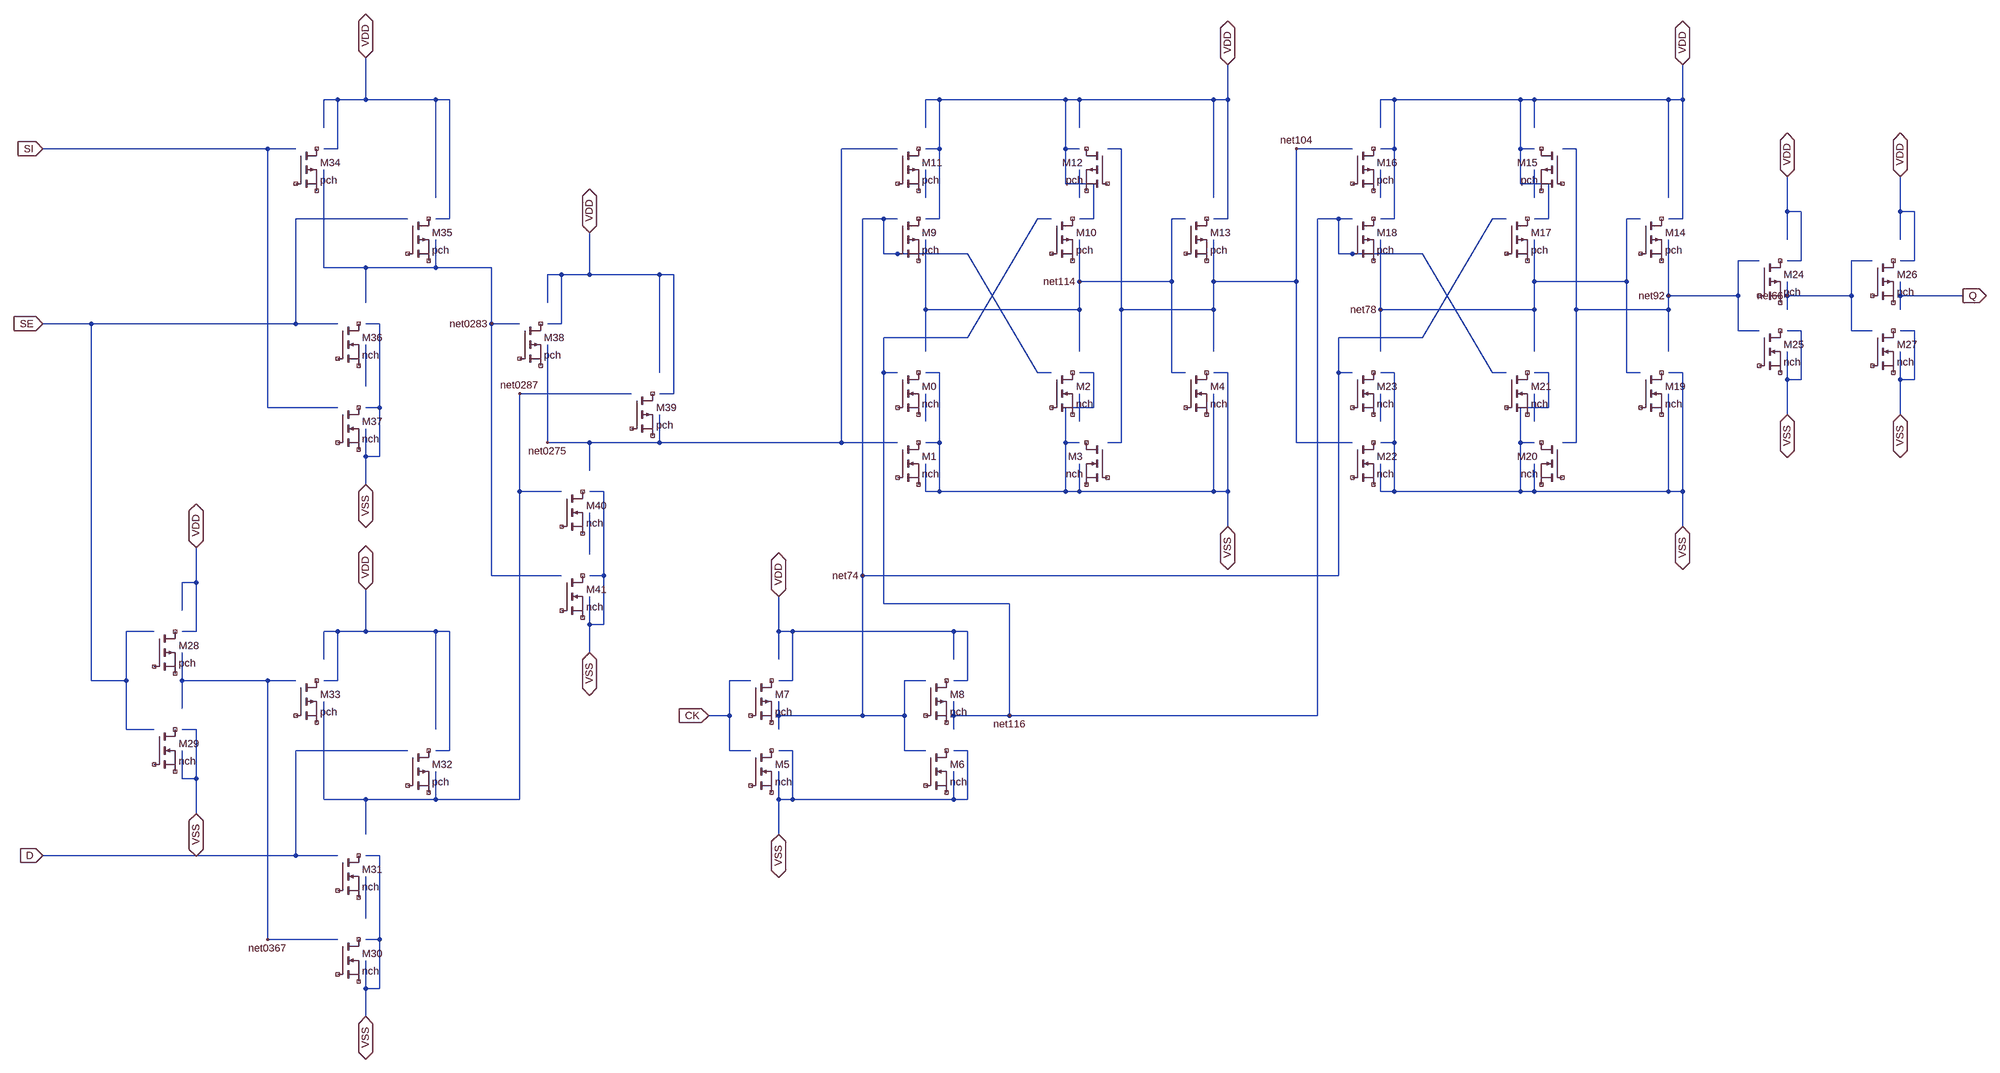
[diagram p0: schematic sdff1.asc]
sdff1.asc, the LTspice schematic file:
Version 4
SHEET 1 4896 2416
WIRE 400 1552 400 1488
WIRE 400 1616 400 1552
WIRE 704 2144 864 2144
WIRE 400 1552 704 1552
WIRE 704 1552 768 1552
WIRE 704 2144 704 1552
WIRE 2560 640 2784 640
WIRE 2784 640 2784 496
WIRE 2560 640 2560 544
WIRE 2784 848 2816 848
WIRE 2784 848 2784 640
WIRE 2784 496 2816 496
WIRE 2208 704 2560 704
WIRE 2560 704 2560 640
WIRE 2208 704 2208 544
WIRE 2560 800 2560 704
WIRE 2208 800 2208 704
WIRE 1712 1632 1760 1632
WIRE 1760 1632 1760 1552
WIRE 1760 1712 1808 1712
WIRE 1760 1712 1760 1632
WIRE 1760 1552 1808 1552
WIRE 3136 336 3264 336
WIRE 2880 640 3136 640
WIRE 3136 1008 3136 640
WIRE 2880 704 2880 640
WIRE 2880 640 2880 544
WIRE 3136 1008 3264 1008
WIRE 2656 704 2880 704
WIRE 3136 640 3136 336
WIRE 2656 704 2656 336
WIRE 2624 1008 2656 1008
WIRE 2656 1008 2656 704
WIRE 2624 336 2656 336
WIRE 2880 800 2880 704
WIRE 4368 672 4528 672
WIRE 4528 672 4528 592
WIRE 4368 672 4368 640
WIRE 4528 752 4528 672
WIRE 4528 752 4576 752
WIRE 4528 592 4576 592
WIRE 4368 704 4368 672
WIRE 3328 960 3328 896
WIRE 1280 1824 1280 1120
WIRE 1280 896 1536 896
WIRE 1280 1120 1376 1120
WIRE 1280 1120 1280 896
WIRE 928 1904 928 1824
WIRE 928 1824 1088 1824
WIRE 832 1824 928 1824
WIRE 832 1824 832 1600
WIRE 1088 1824 1088 1760
WIRE 1088 1824 1280 1824
WIRE 2400 1632 3184 1632
WIRE 3184 496 3232 496
WIRE 3232 496 3264 496
WIRE 3232 576 3232 496
WIRE 3232 576 3424 576
WIRE 3584 848 3616 848
WIRE 3424 576 3584 848
WIRE 3184 1632 3184 496
WIRE 2272 1632 2272 1600
WIRE 2112 1376 2400 1376
WIRE 2272 1632 2400 1632
WIRE 2400 1632 2400 1376
WIRE 2112 1376 2112 848
WIRE 2304 768 2464 496
WIRE 2272 1664 2272 1632
WIRE 2464 496 2496 496
WIRE 2112 768 2304 768
WIRE 2112 848 2112 768
WIRE 2112 848 2144 848
WIRE 928 688 928 608
WIRE 1216 1312 1216 736
WIRE 1216 736 1216 608
WIRE 1216 736 1280 736
WIRE 1216 1312 1376 1312
WIRE 1088 608 1216 608
WIRE 1088 608 1088 544
WIRE 832 608 832 384
WIRE 832 608 928 608
WIRE 928 608 1088 608
WIRE 2208 960 2208 896
WIRE 2208 448 2208 384
WIRE 1440 1264 1440 1168
WIRE 768 1712 1024 1712
WIRE 80 1952 768 1952
WIRE 768 1952 864 1952
WIRE 768 1952 768 1712
WIRE 4000 672 4256 672
WIRE 4256 672 4256 592
WIRE 4000 672 4000 544
WIRE 4256 752 4256 672
WIRE 4256 752 4304 752
WIRE 4256 592 4304 592
WIRE 3744 336 3776 336
WIRE 3744 1008 3776 1008
WIRE 3776 704 3776 336
WIRE 3776 1008 3776 704
WIRE 4000 704 4000 672
WIRE 4000 800 4000 704
WIRE 3776 704 4000 704
WIRE 928 880 928 784
WIRE 1600 1008 1600 944
WIRE 1344 1008 1440 1008
WIRE 1344 1008 1344 784
WIRE 1440 1008 1600 1008
WIRE 1440 1072 1440 1008
WIRE 1600 1008 2016 1008
WIRE 2016 1008 2016 336
WIRE 2016 1008 2144 1008
WIRE 2016 336 2144 336
WIRE 3680 960 3680 896
WIRE 2064 1312 3232 1312
WIRE 3232 848 3264 848
WIRE 3232 848 3232 768
WIRE 3232 768 3424 768
WIRE 3584 496 3616 496
WIRE 3424 768 3584 496
WIRE 2064 1632 2160 1632
WIRE 2064 1632 2064 1312
WIRE 3232 1312 3232 848
WIRE 2304 576 2464 848
WIRE 1872 1632 2064 1632
WIRE 2160 1632 2160 1552
WIRE 2064 496 2112 496
WIRE 2160 1712 2160 1632
WIRE 1872 1664 1872 1632
WIRE 2160 1552 2208 1552
WIRE 2160 1712 2208 1712
WIRE 1872 1632 1872 1600
WIRE 2064 1312 2064 496
WIRE 2464 848 2496 848
WIRE 2112 576 2304 576
WIRE 2112 576 2112 496
WIRE 2112 496 2144 496
WIRE 3328 800 3328 704
WIRE 3680 800 3680 704
WIRE 3328 704 3328 544
WIRE 3680 704 3680 640
WIRE 3328 704 3680 704
WIRE 3904 496 3936 496
WIRE 3904 848 3904 640
WIRE 3904 848 3936 848
WIRE 3680 640 3680 544
WIRE 3904 640 3904 496
WIRE 3680 640 3904 640
WIRE 4640 672 4800 672
WIRE 4640 672 4640 640
WIRE 4640 704 4640 672
WIRE 3328 448 3328 384
WIRE 3680 448 3680 384
WIRE 2560 448 2560 384
WIRE 928 2096 928 2000
WIRE 2560 960 2560 896
WIRE 80 336 704 336
WIRE 704 336 768 336
WIRE 704 928 864 928
WIRE 704 928 704 336
WIRE 1440 1120 1472 1120
WIRE 1440 1312 1472 1312
WIRE 1472 1424 1472 1312
WIRE 1440 1424 1472 1424
WIRE 1440 1424 1440 1360
WIRE 1440 1488 1440 1424
WIRE 1472 1312 1472 1120
WIRE 432 1776 432 1856
WIRE 400 1776 432 1776
WIRE 432 1776 432 1664
WIRE 400 1664 432 1664
WIRE 400 1776 400 1712
WIRE 960 2144 960 1952
WIRE 928 2320 928 2256
WIRE 928 2256 928 2192
WIRE 928 2256 960 2256
WIRE 960 2256 960 2144
WIRE 928 1952 960 1952
WIRE 928 2144 960 2144
WIRE 928 736 960 736
WIRE 928 928 960 928
WIRE 960 1040 960 928
WIRE 928 1040 960 1040
WIRE 928 1040 928 976
WIRE 928 1104 928 1040
WIRE 960 928 960 736
WIRE 4640 864 4640 944
WIRE 4672 864 4672 752
WIRE 4640 864 4672 864
WIRE 4640 752 4672 752
WIRE 4640 800 4640 864
WIRE 4368 864 4368 944
WIRE 4400 864 4400 752
WIRE 4368 864 4400 864
WIRE 4368 752 4400 752
WIRE 4368 800 4368 864
WIRE 3328 1120 3328 1056
WIRE 3328 1120 3360 1120
WIRE 3680 1120 3680 1056
WIRE 3328 848 3360 848
WIRE 3360 1120 3648 1120
WIRE 3360 1120 3360 1008
WIRE 3360 1008 3360 848
WIRE 3328 1008 3360 1008
WIRE 3680 848 3712 848
WIRE 3712 928 3712 848
WIRE 3648 928 3712 928
WIRE 3648 1120 3680 1120
WIRE 3648 1120 3648 1008
WIRE 3648 1008 3648 928
WIRE 3648 1008 3680 1008
WIRE 3680 1120 4000 1120
WIRE 4000 1120 4000 896
WIRE 4000 848 4032 848
WIRE 4032 1120 4032 848
WIRE 4000 1120 4032 1120
WIRE 4032 1120 4032 1200
WIRE 1872 1824 1872 1904
WIRE 2272 1824 2304 1824
WIRE 2304 1824 2304 1712
WIRE 2272 1712 2304 1712
WIRE 1904 1824 1904 1712
WIRE 1872 1712 1904 1712
WIRE 1872 1760 1872 1824
WIRE 1872 1824 1904 1824
WIRE 2272 1760 2272 1824
WIRE 2912 1120 2912 1200
WIRE 2880 1120 2912 1120
WIRE 2912 1120 2912 848
WIRE 2880 848 2912 848
WIRE 2880 1120 2880 896
WIRE 2560 1120 2880 1120
WIRE 2528 1008 2560 1008
WIRE 2528 1008 2528 928
WIRE 2528 1120 2528 1008
WIRE 2528 1120 2560 1120
WIRE 2528 928 2592 928
WIRE 2592 928 2592 848
WIRE 2560 848 2592 848
WIRE 2208 1008 2240 1008
WIRE 2240 1008 2240 848
WIRE 2240 1120 2240 1008
WIRE 2240 1120 2528 1120
WIRE 2208 848 2240 848
WIRE 2560 1120 2560 1056
WIRE 2208 1120 2240 1120
WIRE 2208 1120 2208 1056
WIRE 1904 1824 2272 1824
WIRE 80 736 192 736
WIRE 272 1552 272 1440
WIRE 272 1440 336 1440
WIRE 272 1664 336 1664
WIRE 272 1664 272 1552
WIRE 192 1552 272 1552
WIRE 192 1552 192 736
WIRE 768 736 864 736
WIRE 768 496 1024 496
WIRE 192 736 768 736
WIRE 768 736 768 496
WIRE 1344 736 1376 736
WIRE 1376 736 1376 624
WIRE 1344 624 1376 624
WIRE 1344 688 1344 624
WIRE 1376 624 1440 624
WIRE 1600 848 1600 624
WIRE 1600 896 1632 896
WIRE 1632 896 1632 624
WIRE 1600 624 1632 624
WIRE 1440 624 1600 624
WIRE 1440 528 1440 624
WIRE 432 1248 432 1328
WIRE 400 1328 432 1328
WIRE 432 1440 432 1328
WIRE 400 1440 432 1440
WIRE 400 1392 400 1328
WIRE 928 1344 928 1440
WIRE 928 1440 1088 1440
WIRE 1088 1440 1120 1440
WIRE 1120 1712 1120 1440
WIRE 1088 1712 1120 1712
WIRE 1088 1664 1088 1440
WIRE 864 1440 928 1440
WIRE 832 1504 832 1440
WIRE 832 1440 864 1440
WIRE 864 1552 864 1440
WIRE 832 1552 864 1552
WIRE 832 336 864 336
WIRE 864 336 864 224
WIRE 832 224 864 224
WIRE 832 288 832 224
WIRE 864 224 928 224
WIRE 1088 448 1088 224
WIRE 1088 496 1120 496
WIRE 1120 496 1120 224
WIRE 1088 224 1120 224
WIRE 928 224 1088 224
WIRE 928 128 928 224
WIRE 4672 592 4672 480
WIRE 4640 480 4672 480
WIRE 4640 592 4672 592
WIRE 4640 544 4640 480
WIRE 4640 480 4640 400
WIRE 4400 592 4400 480
WIRE 4368 480 4400 480
WIRE 4368 592 4400 592
WIRE 4368 544 4368 480
WIRE 4368 480 4368 400
WIRE 3328 288 3328 224
WIRE 3328 224 3360 224
WIRE 3680 288 3680 224
WIRE 3680 496 3712 496
WIRE 3712 496 3712 416
WIRE 3648 416 3712 416
WIRE 3648 224 3680 224
WIRE 3648 416 3648 336
WIRE 3648 336 3648 224
WIRE 3648 336 3680 336
WIRE 3328 496 3360 496
WIRE 3360 224 3648 224
WIRE 3360 496 3360 336
WIRE 3360 336 3360 224
WIRE 3328 336 3360 336
WIRE 3680 224 4000 224
WIRE 4000 448 4000 224
WIRE 4000 496 4032 496
WIRE 4032 496 4032 224
WIRE 4000 224 4032 224
WIRE 4032 224 4032 144
WIRE 1872 1440 1872 1360
WIRE 2272 1440 2304 1440
WIRE 2304 1552 2304 1440
WIRE 2272 1552 2304 1552
WIRE 1904 1552 1904 1440
WIRE 1872 1552 1904 1552
WIRE 2272 1504 2272 1440
WIRE 1872 1504 1872 1440
WIRE 1872 1440 1904 1440
WIRE 2912 224 2912 144
WIRE 2880 224 2912 224
WIRE 2912 496 2912 224
WIRE 2880 496 2912 496
WIRE 2880 448 2880 224
WIRE 2560 224 2880 224
WIRE 2208 336 2240 336
WIRE 2240 336 2240 224
WIRE 2240 496 2240 336
WIRE 2240 224 2528 224
WIRE 2208 496 2240 496
WIRE 2528 336 2560 336
WIRE 2528 336 2528 224
WIRE 2528 416 2528 336
WIRE 2528 224 2560 224
WIRE 2528 416 2592 416
WIRE 2592 496 2592 416
WIRE 2560 496 2592 496
WIRE 2560 288 2560 224
WIRE 2208 224 2240 224
WIRE 2208 288 2208 224
WIRE 1904 1440 2272 1440
FLAG 704 2144 net0367
FLAG 2560 640 net114
FLAG 3136 336 net104
FLAG 4368 672 net66
FLAG 1280 896 net0287
FLAG 2400 1632 net116
FLAG 1216 736 net0283
FLAG 4000 672 net92
FLAG 1344 1008 net0275
FLAG 2064 1312 net74
FLAG 3328 704 net78
SYMBOL PMOS 1536 896 R0
SYMATTR InstName M39
SYMATTR Value pch
SYMATTR Value2 w=6u l=1u
SYMBOL PMOS 336 1440 R0
SYMATTR InstName M28
SYMATTR Value pch
SYMATTR Value2 w=6u l=1u
SYMBOL PMOS 1024 1712 R0
SYMATTR InstName M32
SYMATTR Value pch
SYMATTR Value2 w=6u l=1u
SYMBOL PMOS 768 1552 R0
SYMATTR InstName M33
SYMATTR Value pch
SYMATTR Value2 w=6u l=1u
SYMBOL PMOS 768 336 R0
SYMATTR InstName M34
SYMATTR Value pch
SYMATTR Value2 w=6u l=1u
SYMBOL PMOS 1024 496 R0
SYMATTR InstName M35
SYMATTR Value pch
SYMATTR Value2 w=6u l=1u
SYMBOL PMOS 1280 736 R0
SYMATTR InstName M38
SYMATTR Value pch
SYMATTR Value2 w=6u l=1u
SYMBOL PMOS 4576 592 R0
SYMATTR InstName M26
SYMATTR Value pch
SYMATTR Value2 w=6u l=1u
SYMBOL PMOS 4304 592 R0
SYMATTR InstName M24
SYMATTR Value pch
SYMATTR Value2 w=6u l=1u
SYMBOL PMOS 3264 496 R0
SYMATTR InstName M18
SYMATTR Value pch
SYMATTR Value2 w=6u l=1u
SYMBOL PMOS 3616 496 R0
SYMATTR InstName M17
SYMATTR Value pch
SYMATTR Value2 w=6u l=1u
SYMBOL PMOS 3264 336 R0
SYMATTR InstName M16
SYMATTR Value pch
SYMATTR Value2 w=6u l=1u
SYMBOL PMOS 3744 336 M0
SYMATTR InstName M15
SYMATTR Value pch
SYMATTR Value2 w=6u l=1u
SYMBOL PMOS 3936 496 R0
SYMATTR InstName M14
SYMATTR Value pch
SYMATTR Value2 w=6u l=1u
SYMBOL PMOS 2816 496 R0
SYMATTR InstName M13
SYMATTR Value pch
SYMATTR Value2 w=6u l=1u
SYMBOL PMOS 2624 336 M0
SYMATTR InstName M12
SYMATTR Value pch
SYMATTR Value2 w=6u l=1u
SYMBOL PMOS 2144 336 R0
SYMATTR InstName M11
SYMATTR Value pch
SYMATTR Value2 w=6u l=1u
SYMBOL PMOS 2496 496 R0
SYMATTR InstName M10
SYMATTR Value pch
SYMATTR Value2 w=6u l=1u
SYMBOL PMOS 2144 496 R0
SYMATTR InstName M9
SYMATTR Value pch
SYMATTR Value2 w=6u l=1u
SYMBOL PMOS 2208 1552 R0
SYMATTR InstName M8
SYMATTR Value pch
SYMATTR Value2 w=6u l=1u
SYMBOL PMOS 1808 1552 R0
SYMATTR InstName M7
SYMATTR Value pch
SYMATTR Value2 w=6u l=1u
SYMBOL NMOS 1376 1312 R0
SYMATTR InstName M41
SYMATTR Value nch
SYMATTR Value2 w=2u l=1u
SYMBOL NMOS 1376 1120 R0
SYMATTR InstName M40
SYMATTR Value nch
SYMATTR Value2 w=2u l=1u
SYMBOL NMOS 336 1664 R0
SYMATTR InstName M29
SYMATTR Value nch
SYMATTR Value2 w=2u l=1u
SYMBOL NMOS 864 2144 R0
SYMATTR InstName M30
SYMATTR Value nch
SYMATTR Value2 w=2u l=1u
SYMBOL NMOS 864 1952 R0
SYMATTR InstName M31
SYMATTR Value nch
SYMATTR Value2 w=2u l=1u
SYMBOL NMOS 864 736 R0
SYMATTR InstName M36
SYMATTR Value nch
SYMATTR Value2 w=2u l=1u
SYMBOL NMOS 864 928 R0
SYMATTR InstName M37
SYMATTR Value nch
SYMATTR Value2 w=2u l=1u
SYMBOL NMOS 4576 752 R0
SYMATTR InstName M27
SYMATTR Value nch
SYMATTR Value2 w=2u l=1u
SYMBOL NMOS 4304 752 R0
SYMATTR InstName M25
SYMATTR Value nch
SYMATTR Value2 w=2u l=1u
SYMBOL NMOS 3264 848 R0
SYMATTR InstName M23
SYMATTR Value nch
SYMATTR Value2 w=2u l=1u
SYMBOL NMOS 3264 1008 R0
SYMATTR InstName M22
SYMATTR Value nch
SYMATTR Value2 w=2u l=1u
SYMBOL NMOS 3616 848 R0
SYMATTR InstName M21
SYMATTR Value nch
SYMATTR Value2 w=2u l=1u
SYMBOL NMOS 3744 1008 M0
SYMATTR InstName M20
SYMATTR Value nch
SYMATTR Value2 w=2u l=1u
SYMBOL NMOS 3936 848 R0
SYMATTR InstName M19
SYMATTR Value nch
SYMATTR Value2 w=2u l=1u
SYMBOL NMOS 2208 1712 R0
SYMATTR InstName M6
SYMATTR Value nch
SYMATTR Value2 w=2u l=1u
SYMBOL NMOS 1808 1712 R0
SYMATTR InstName M5
SYMATTR Value nch
SYMATTR Value2 w=2u l=1u
SYMBOL NMOS 2816 848 R0
SYMATTR InstName M4
SYMATTR Value nch
SYMATTR Value2 w=2u l=1u
SYMBOL NMOS 2624 1008 M0
SYMATTR InstName M3
SYMATTR Value nch
SYMATTR Value2 w=2u l=1u
SYMBOL NMOS 2496 848 R0
SYMATTR InstName M2
SYMATTR Value nch
SYMATTR Value2 w=2u l=1u
SYMBOL NMOS 2144 1008 R0
SYMATTR InstName M1
SYMATTR Value nch
SYMATTR Value2 w=2u l=1u
SYMBOL NMOS 2144 848 R0
SYMATTR InstName M0
SYMATTR Value nch
SYMATTR Value2 w=2u l=1u
FLAG 4800 672 Q
IOPIN 4800 672 Out
FLAG 1440 1488 VSS
IOPIN 1440 1488 BiDir
FLAG 1440 528 VDD
IOPIN 1440 528 BiDir
FLAG 432 1856 VSS
IOPIN 432 1856 BiDir
FLAG 432 1248 VDD
IOPIN 432 1248 BiDir
FLAG 928 2320 VSS
IOPIN 928 2320 BiDir
FLAG 928 1344 VDD
IOPIN 928 1344 BiDir
FLAG 928 128 VDD
IOPIN 928 128 BiDir
FLAG 928 1104 VSS
IOPIN 928 1104 BiDir
FLAG 4640 400 VDD
IOPIN 4640 400 BiDir
FLAG 4640 944 VSS
IOPIN 4640 944 BiDir
FLAG 4368 400 VDD
IOPIN 4368 400 BiDir
FLAG 4368 944 VSS
IOPIN 4368 944 BiDir
FLAG 4032 1200 VSS
IOPIN 4032 1200 BiDir
FLAG 4032 144 VDD
IOPIN 4032 144 BiDir
FLAG 1872 1360 VDD
IOPIN 1872 1360 BiDir
FLAG 1872 1904 VSS
IOPIN 1872 1904 BiDir
FLAG 2912 1200 VSS
IOPIN 2912 1200 BiDir
FLAG 2912 144 VDD
IOPIN 2912 144 BiDir
FLAG 80 336 SI
IOPIN 80 336 In
FLAG 80 736 SE
IOPIN 80 736 In
FLAG 80 1952 D
IOPIN 80 1952 In
FLAG 1712 1632 CK
IOPIN 1712 1632 In

The netlist it stands for:
* sdff1.asc
* M39: pch w=6u l=1u (symbol PMOS not certain, pin order unknown); nets seen at it: 
* M28: pch w=6u l=1u (symbol PMOS not certain, pin order unknown); nets seen at it: 
* M32: pch w=6u l=1u (symbol PMOS not certain, pin order unknown); nets seen at it: 
* M33: pch w=6u l=1u (symbol PMOS not certain, pin order unknown); nets seen at it: 
* M34: pch w=6u l=1u (symbol PMOS not certain, pin order unknown); nets seen at it: 
* M35: pch w=6u l=1u (symbol PMOS not certain, pin order unknown); nets seen at it: 
* M38: pch w=6u l=1u (symbol PMOS not certain, pin order unknown); nets seen at it: 
* M26: pch w=6u l=1u (symbol PMOS not certain, pin order unknown); nets seen at it: 
* M24: pch w=6u l=1u (symbol PMOS not certain, pin order unknown); nets seen at it: 
* M18: pch w=6u l=1u (symbol PMOS not certain, pin order unknown); nets seen at it: net116
* M17: pch w=6u l=1u (symbol PMOS not certain, pin order unknown); nets seen at it: 
* M16: pch w=6u l=1u (symbol PMOS not certain, pin order unknown); nets seen at it: 
* M15: pch w=6u l=1u (symbol PMOS not certain, pin order unknown); nets seen at it: 
* M14: pch w=6u l=1u (symbol PMOS not certain, pin order unknown); nets seen at it: 
* M13: pch w=6u l=1u (symbol PMOS not certain, pin order unknown); nets seen at it: 
* M12: pch w=6u l=1u (symbol PMOS not certain, pin order unknown); nets seen at it: 
* M11: pch w=6u l=1u (symbol PMOS not certain, pin order unknown); nets seen at it: 
* M10: pch w=6u l=1u (symbol PMOS not certain, pin order unknown); nets seen at it: 
* M9: pch w=6u l=1u (symbol PMOS not certain, pin order unknown); nets seen at it: net74
* M8: pch w=6u l=1u (symbol PMOS not certain, pin order unknown); nets seen at it: 
* M7: pch w=6u l=1u (symbol PMOS not certain, pin order unknown); nets seen at it: 
* M41: nch w=2u l=1u (symbol NMOS not certain, pin order unknown); nets seen at it: 
* M40: nch w=2u l=1u (symbol NMOS not certain, pin order unknown); nets seen at it: 
* M29: nch w=2u l=1u (symbol NMOS not certain, pin order unknown); nets seen at it: 
* M30: nch w=2u l=1u (symbol NMOS not certain, pin order unknown); nets seen at it: 
* M31: nch w=2u l=1u (symbol NMOS not certain, pin order unknown); nets seen at it: 
* M36: nch w=2u l=1u (symbol NMOS not certain, pin order unknown); nets seen at it: 
* M37: nch w=2u l=1u (symbol NMOS not certain, pin order unknown); nets seen at it: 
* M27: nch w=2u l=1u (symbol NMOS not certain, pin order unknown); nets seen at it: 
* M25: nch w=2u l=1u (symbol NMOS not certain, pin order unknown); nets seen at it: 
* M23: nch w=2u l=1u (symbol NMOS not certain, pin order unknown); nets seen at it: 
* M22: nch w=2u l=1u (symbol NMOS not certain, pin order unknown); nets seen at it: 
* M21: nch w=2u l=1u (symbol NMOS not certain, pin order unknown); nets seen at it: 
* M20: nch w=2u l=1u (symbol NMOS not certain, pin order unknown); nets seen at it: 
* M19: nch w=2u l=1u (symbol NMOS not certain, pin order unknown); nets seen at it: 
* M6: nch w=2u l=1u (symbol NMOS not certain, pin order unknown); nets seen at it: 
* M5: nch w=2u l=1u (symbol NMOS not certain, pin order unknown); nets seen at it: 
* M4: nch w=2u l=1u (symbol NMOS not certain, pin order unknown); nets seen at it: 
* M3: nch w=2u l=1u (symbol NMOS not certain, pin order unknown); nets seen at it: 
* M2: nch w=2u l=1u (symbol NMOS not certain, pin order unknown); nets seen at it: 
* M1: nch w=2u l=1u (symbol NMOS not certain, pin order unknown); nets seen at it: 
* M0: nch w=2u l=1u (symbol NMOS not certain, pin order unknown); nets seen at it: 
.backanno
.end